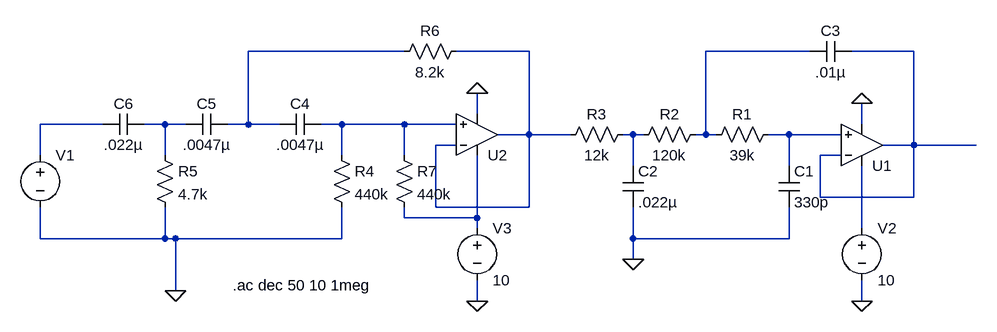
[diagram p0: schematic SixthBPWider200.asc]
SixthBPWider200.asc, the LTspice schematic file:
Version 4
SHEET 1 1348 680
WIRE 464 64 224 64
WIRE 656 64 544 64
WIRE 1088 64 928 64
WIRE 1248 64 1152 64
WIRE 576 160 576 128
WIRE 0 176 -96 176
WIRE 96 176 64 176
WIRE 128 176 96 176
WIRE 224 176 224 64
WIRE 224 176 192 176
WIRE 272 176 224 176
WIRE 368 176 336 176
WIRE 464 176 368 176
WIRE 544 176 464 176
WIRE 1168 176 1168 144
WIRE 656 192 656 64
WIRE 656 192 608 192
WIRE 720 192 656 192
WIRE 816 192 800 192
WIRE 832 192 816 192
WIRE 928 192 928 64
WIRE 928 192 912 192
WIRE 944 192 928 192
WIRE 1056 192 1024 192
WIRE 1136 192 1056 192
WIRE 544 208 512 208
WIRE 1248 208 1248 64
WIRE 1248 208 1200 208
WIRE 1344 208 1248 208
WIRE -96 224 -96 176
WIRE 96 224 96 176
WIRE 368 224 368 176
WIRE 464 224 464 176
WIRE 1136 224 1104 224
WIRE 816 240 816 192
WIRE 1056 240 1056 192
WIRE 1104 288 1104 224
WIRE 1248 288 1248 208
WIRE 1248 288 1104 288
WIRE 512 304 512 208
WIRE 656 304 656 192
WIRE 656 304 512 304
WIRE 464 320 464 304
WIRE 576 320 576 224
WIRE 576 320 464 320
WIRE 576 336 576 320
WIRE 1168 336 1168 240
WIRE -96 352 -96 304
WIRE 96 352 96 304
WIRE 96 352 -96 352
WIRE 112 352 96 352
WIRE 368 352 368 304
WIRE 368 352 112 352
WIRE 816 352 816 304
WIRE 1056 352 1056 304
WIRE 1056 352 816 352
WIRE 816 384 816 352
WIRE 112 432 112 352
WIRE 576 448 576 416
WIRE 1168 448 1168 416
FLAG 816 384 0
FLAG 1168 448 0
FLAG 112 432 0
FLAG 576 448 0
FLAG 576 128 0
FLAG 1168 144 0
SYMBOL res 1040 176 R90
WINDOW 0 0 56 VBottom 2
WINDOW 3 32 56 VTop 2
SYMATTR InstName R1
SYMATTR Value 39k
SYMBOL res 928 176 R90
WINDOW 0 0 56 VBottom 2
WINDOW 3 32 56 VTop 2
SYMATTR InstName R2
SYMATTR Value 120k
SYMBOL res 816 176 R90
WINDOW 0 0 56 VBottom 2
WINDOW 3 32 56 VTop 2
SYMATTR InstName R3
SYMATTR Value 12k
SYMBOL cap 1040 240 R0
SYMATTR InstName C1
SYMATTR Value 330p
SYMBOL cap 800 240 R0
SYMATTR InstName C2
SYMATTR Value .022µ
SYMBOL cap 1152 48 R90
WINDOW 0 0 32 VBottom 2
WINDOW 3 32 32 VTop 2
SYMATTR InstName C3
SYMATTR Value .01µ
SYMBOL voltage -96 208 R0
SYMATTR InstName V1
SYMATTR Value ""
SYMATTR Value2 AC 1
SYMBOL Opamps/UniversalOpamp2 1168 208 M180
SYMATTR InstName U1
SYMBOL voltage 1168 320 R0
SYMATTR InstName V2
SYMATTR Value 10
SYMBOL Opamps/UniversalOpamp2 576 192 M180
SYMATTR InstName U2
SYMBOL cap 336 160 R90
WINDOW 0 0 32 VBottom 2
WINDOW 3 32 32 VTop 2
SYMATTR InstName C4
SYMATTR Value .0047µ
SYMBOL cap 192 160 R90
WINDOW 0 0 32 VBottom 2
WINDOW 3 32 32 VTop 2
SYMATTR InstName C5
SYMATTR Value .0047µ
SYMBOL cap 64 160 R90
WINDOW 0 0 32 VBottom 2
WINDOW 3 32 32 VTop 2
SYMATTR InstName C6
SYMATTR Value .022µ
SYMBOL res 352 208 R0
SYMATTR InstName R4
SYMATTR Value 440k
SYMBOL res 80 208 R0
SYMATTR InstName R5
SYMATTR Value 4.7k
SYMBOL res 560 48 R90
WINDOW 0 0 56 VBottom 2
WINDOW 3 32 56 VTop 2
SYMATTR InstName R6
SYMATTR Value 8.2k
SYMBOL voltage 576 320 R0
SYMATTR InstName V3
SYMATTR Value 10
SYMBOL res 448 208 R0
SYMATTR InstName R7
SYMATTR Value 440k
TEXT 200 424 Left 2 !.ac dec 50 10 1meg

The netlist it stands for:
* SixthBPWider200.asc
R1 N009 N003 39k
R2 N003 N008 120k
R3 N008 N002 12k
C1 N009 0 330p
C2 N008 0 .022µ
C3 N004 N003 .01µ
V1 N005 0 AC 1
XU1 N009 N004 N011 0 N004 level.2 Avol=1Meg GBW=10Meg Slew=10Meg ilimit=25m rail=0 Vos=0 phimargin=45 en=0 enk=0 in=0 ink=0 Rin=500Meg  ; pins IN+ IN- V+ V- OUT
V2 N011 0 10
XU2 N007 N002 N010 0 N002 level.2 Avol=1Meg GBW=10Meg Slew=10Meg ilimit=25m rail=0 Vos=0 phimargin=45 en=0 enk=0 in=0 ink=0 Rin=500Meg  ; pins IN+ IN- V+ V- OUT
C4 N007 N001 .0047µ
C5 N001 N006 .0047µ
C6 N006 N005 .022µ
R4 N007 0 440k
R5 N006 0 4.7k
R6 N002 N001 8.2k
V3 N010 0 10
R7 N007 N010 440k
.ac dec 50 10 1meg
.lib UniversalOpamps2.sub
.backanno
.end